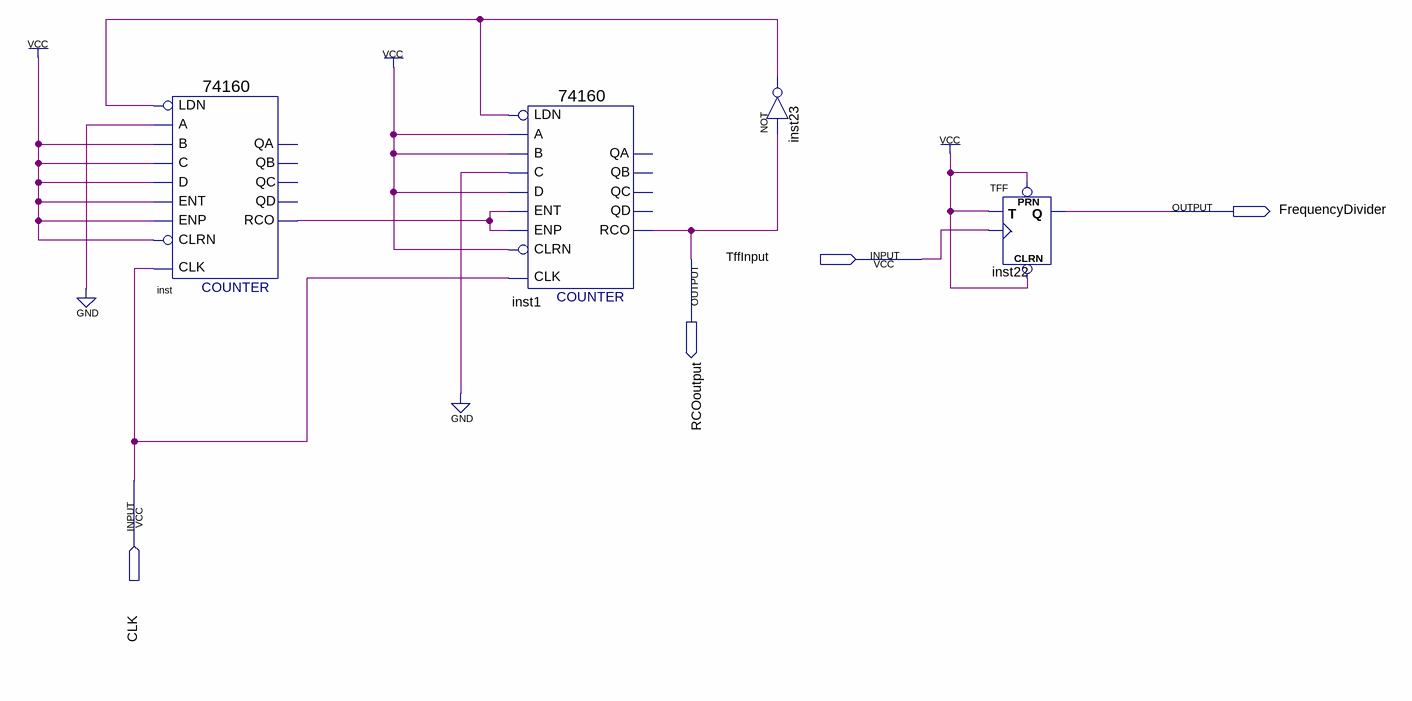
[diagram p0: schematic sheet]
// Quartus schematic FrequencyDivider.bdf as structural Verilog: 4 symbols, 4 pins
module FrequencyDivider (
  input  TffInput,
  input  CLK,
  output FrequencyDivider,
  output RCOoutput
);

  wire inst23_out, inst_rco;

  \74160  inst (
    .CLK(CLK), .ENT(1'b1), .A(1'b0), .B(1'b1), .C(1'b1), .D(1'b1), .LDN(inst23_out), .ENP(1'b1), .CLRN(1'b1),
    .RCO(inst_rco));  // open: QD, QA, QB, QC
  \74160  inst1 (
    .CLK(CLK), .ENT(inst_rco), .A(1'b1), .B(1'b1), .C(1'b0), .D(1'b1), .LDN(inst23_out), .ENP(inst_rco),
    .CLRN(1'b1), .RCO(RCOoutput));  // open: QD, QA, QB, QC
  not inst23 (inst23_out, RCOoutput);
  TFF inst22 (.PRN(1'b1), .CLRN(1'b1), .T(1'b1), .CLK(TffInput), .Q(FrequencyDivider));
endmodule
